# EAGLE design EXTRUSOR-NANO -3  (EAGLE 7.2.0)
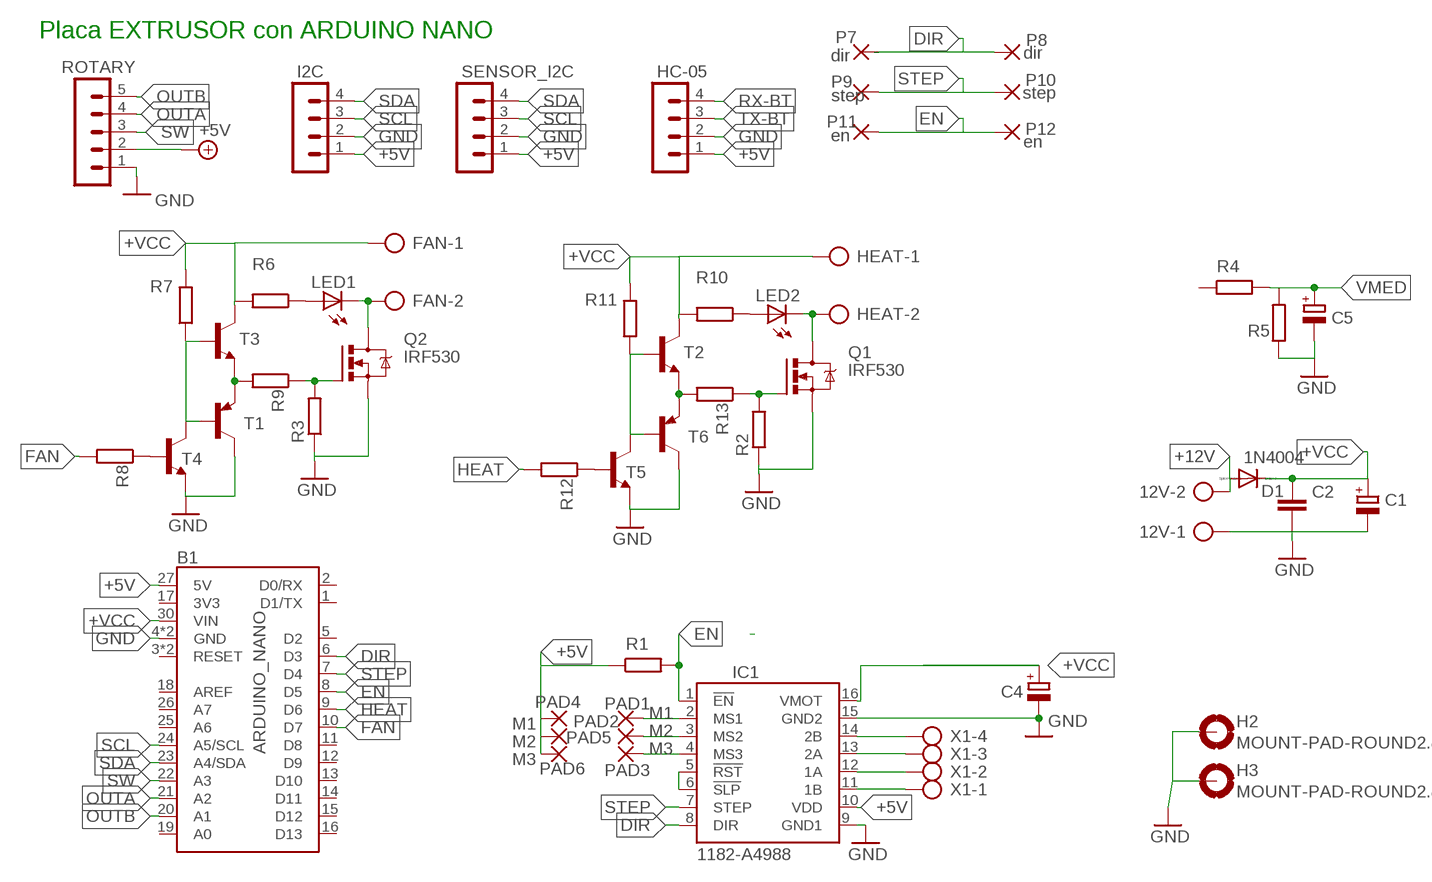
[diagram p0: schematic, sheet 1]

## Parts
12V  AK500/2  [AK500/2]
B1  ARDUINO_NANO  [NANO]
C1  CPOL-EUE2.5-6  [E2,5-6]
C2  C-EU025-025X050  [C025-025X050]
C4  CPOL-EUE2.5-5  [E2,5-5]
C5  CPOL-EUE2.5-5  [E2,5-5]
D1  1N4004  [DO41-10]
FAN  AK500/2  [AK500/2]
H2  MOUNT-PAD-ROUND2.8  [2,8-PAD]
H3  MOUNT-PAD-ROUND2.8  [2,8-PAD]
HC-05  MA04-1  [MA04-1]
HEAT  AK500/2  [AK500/2]
I2C  MA04-1  [MA04-1]
IC1  1182-A4988  [A4988]
LED1  LED3MM  [LED_3MM]
LED2  LED3MM  [LED_3MM]
P7  dir  WIREPAD1,6/0,9  [1,6/0,9]
P8  dir  WIREPAD1,6/0,9  [1,6/0,9]
P9  step  WIREPAD1,6/0,9  [1,6/0,9]
P10  step  WIREPAD1,6/0,9  [1,6/0,9]
P11  en  WIREPAD1,6/0,9  [1,6/0,9]
P12  en  WIREPAD1,6/0,9  [1,6/0,9]
PAD1  M1  WIREPAD1,6/0,9  [1,6/0,9]
PAD2  M2  WIREPAD1,6/0,9  [1,6/0,9]
PAD3  M3  WIREPAD1,6/0,9  [1,6/0,9]
PAD4  M1  WIREPAD1,6/0,9  [1,6/0,9]
PAD5  M2  WIREPAD1,6/0,9  [1,6/0,9]
PAD6  M3  WIREPAD1,6/0,9  [1,6/0,9]
Q1  IRF530  [TO220BV]
Q2  IRF530  [TO220BV]
R1  R-EU_0207/7  [0207/7]
R2  R-EU_0207/7  [0207/7]
R3  R-EU_0207/7  [0207/7]
R4  R-EU_0207/7  [0207/7]
R5  R-EU_0207/7  [0207/7]
R6  R-EU_0207/7  [0207/7]
R7  R-EU_0207/7  [0207/7]
R8  R-EU_0207/7  [0207/7]
R9  R-EU_0207/7  [0207/7]
R10  R-EU_0207/7  [0207/7]
R11  R-EU_0207/7  [0207/7]
R12  R-EU_0207/7  [0207/7]
R13  R-EU_0207/7  [0207/7]
ROTARY  MA05-1  [MA05-1]
SENSOR_I2C  MA04-1  [MA04-1]
T1  2N4126-PNP-TO92-CBE  [TO92-CBE]
T2  -NPN-TO92-EBC  [TO92-EBC]
T3  -NPN-TO92-EBC  [TO92-EBC]
T4  -NPN-TO92-EBC  [TO92-EBC]
T5  -NPN-TO92-EBC  [TO92-EBC]
T6  2N4126-PNP-TO92-CBE  [TO92-CBE]
X1  AK500/4  [AK500/4]

## Nets
+5V: B1.27(5V) HC-05.1 I2C.1 IC1.10(VDD) PAD4.1(P) PAD5.1(P) PAD6.1(P) R1.1 ROTARY.2 SENSOR_I2C.1
+12V: 12V.2 D1.A
+VCC: B1.30(VIN) C1.+ C2.1 C4.+ D1.C FAN.1 HEAT.1 IC1.16(VMOT) R6.2 R7.2 R10.2 R11.2 T2.C T3.C
DIR: B1.6(D3) IC1.8(DIR) P7.1(P) P8.1(P)
EN: B1.8(D5) IC1.1(!EN) P11.1(P) P12.1(P) R1.2
FAN: B1.10(D7) R8.2
GND: 12V.1 B1.4(GND) B1.29(GND) C1.- C2.2 C4.- C5.- H2.B2,8(MOUNT) H3.B2,8(MOUNT) HC-05.2 I2C.2 IC1.9(GND1) IC1.15(GND2) Q1.S Q2.S R2.1 R3.1 R5.1 ROTARY.1 SENSOR_I2C.2 T1.C T4.E T5.E T6.C
HEAT: B1.9(D6) R12.2
N$1: IC1.5(!RST) IC1.6(!SLP)
N$2: IC1.4(MS3) PAD3.1(P)
N$3: IC1.3(MS2) PAD2.1(P)
N$4: IC1.14(2B) X1.4
N$5: IC1.2(MS1) PAD1.1(P)
N$6: LED1.A R6.1
N$7: Q2.G R3.2 R9.1
N$8: R9.2 T1.E T3.E
N$9: IC1.13(2A) X1.3
N$10: IC1.12(1A) X1.2
N$11: IC1.11(1B) X1.1
N$12: LED2.A R10.1
N$13: FAN.2 LED1.K(C) Q2.D
N$14: R7.1 T1.B T3.B T4.C
N$15: R8.1 T4.B
N$16: Q1.G R2.2 R13.1
N$20: HEAT.2 LED2.K(C) Q1.D
N$21: R13.2 T2.E T6.E
N$22: R11.1 T2.B T5.C T6.B
N$23: R12.1 T5.B
OUTA: B1.21(A2) ROTARY.4
OUTB: B1.20(A1) ROTARY.5
RX-BT: HC-05.4
SCL: B1.24(A5/SCL) I2C.3 SENSOR_I2C.3
SDA: B1.23(A4/SDA) I2C.4 SENSOR_I2C.4
STEP: B1.7(D4) IC1.7(STEP) P9.1(P) P10.1(P)
SW: B1.22(A3) ROTARY.3
TX-BT: HC-05.3
VMED: C5.+ R4.2 R5.2
Unconnected: B1.1(D1/TX) B1.2(D0/RX) B1.3(RESET) B1.5(D2) B1.11(D8) B1.12(D9) B1.13(D10) B1.14(D11) B1.15(D12) B1.16(D13) B1.17(3V3) B1.18(AREF) B1.19(A0) B1.25(A6) B1.26(A7) B1.28(RESET) R4.1

## Notes on the sheet
- Placa EXTRUSOR con ARDUINO NANO

## Library data of the parts
12V FAN HEAT = con-ptr500:AK500/2: CONNECTOR; OC_FARNELL: unknown; OC_NEWARK: unknown
B1 = treser_lib:ARDUINO_NANO: Arduino Nano
C1 C4 C5 = rcl:CPOL-EU: POLARIZED CAPACITOR, European symbol
C2 = rcl:C-EU: CAPACITOR, European symbol
D1 = diode:1N4004: DIODE general purpose rectifier, 1 A
H2 H3 = holes:MOUNT-PAD-ROUND: MOUNTING PAD, round
HC-05 I2C SENSOR_I2C = con-lstb:MA04-1: PIN HEADER; OC_FARNELL: unknown; OC_NEWARK: unknown
IC1 = pololu-stepper-driver:1182-A4988: A4988 Stepper Motor Driver Carrier #1182 A4988 Stepper Motor Driver Carrier <https://www.pololu.com/product/1182> in Japan, Suzaku Lab. Ltd. <https://suzakugiken.jp/> #1182 A4988ステッピングモータドライバ <https://szc.jp/po1182>
LED1 LED2 = treser_lib:LED: LEDs
P7-P12 PAD1-PAD6 = wirepad:WIREPAD: Wire PAD connect wire on PCB
Q1 Q2 = transistor-power:IRF530: HEXFET Power MOSFET
R1-R13 = rcl:R-EU_: RESISTOR, European symbol
ROTARY = con-lstb:MA05-1: PIN HEADER; OC_FARNELL: unknown; OC_NEWARK: unknown
T1 T6 = transistor:*-PNP-: PNP Transistror
T2-T5 = transistor:*-NPN-: NPN Transistror BF959 corrected 2008.03.06
X1 = con-ptr500:AK500/4: CONNECTOR; OC_FARNELL: unknown; OC_NEWARK: unknown

## Board
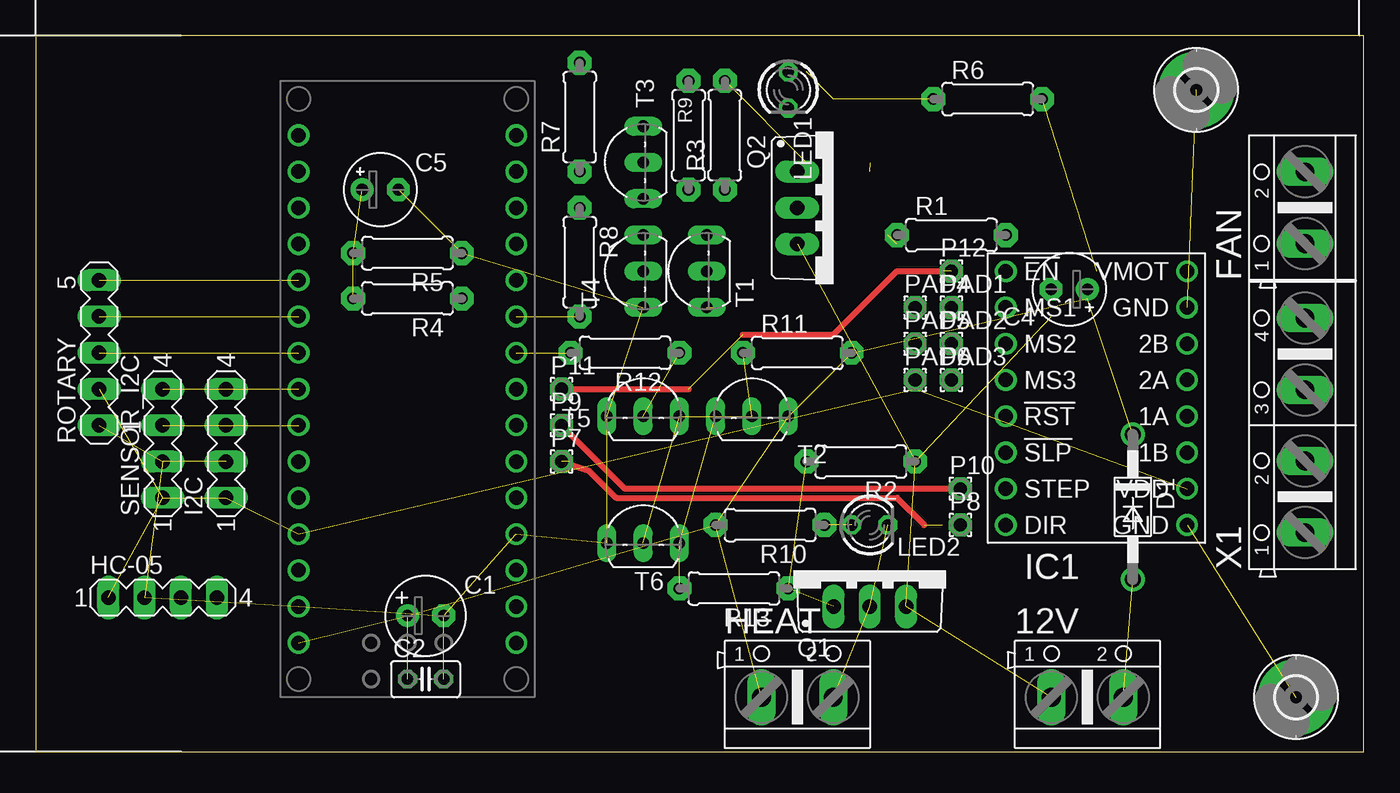
[diagram p1: board, top side]
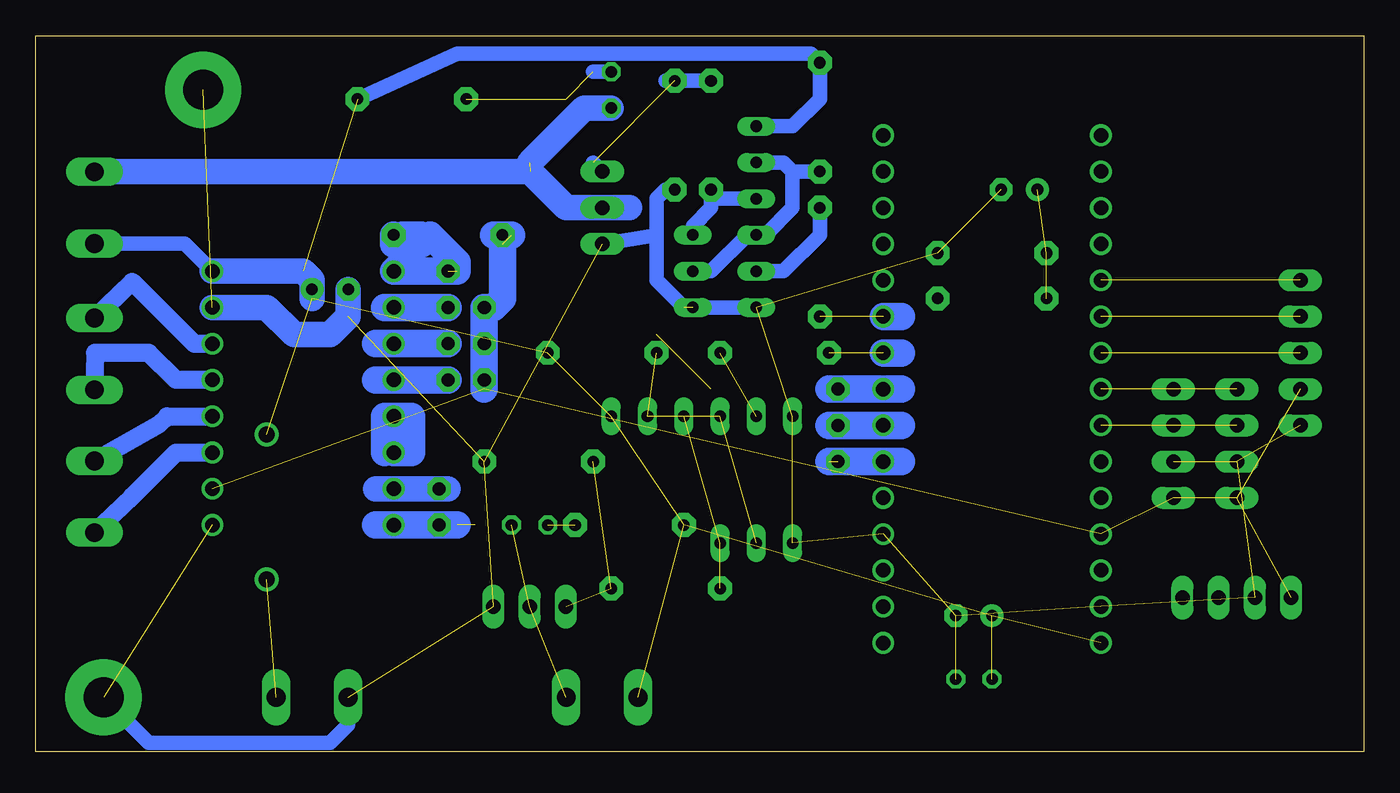
[diagram p2: board, bottom side, seen from below]

Size 93.02 x 50.15 mm. Coordinates in mm from the lower left corner, seen from the top.
Outline: 0,0 93.02,0 93.02,50.15 0,50.15 0,0
Copper layers (1*16): Top 0.035mm / dielectric 1.5mm / Bottom 0.035mm
Design rules "default": minimum track width 10mil, minimum drill 24mil, track to track 8mil, track to pad 8mil, pad to pad 8mil, via to via 8mil, smd to smd 8mil, copper to edge 40mil, drill to drill 8mil, minimum pad ring 10mil, minimum via ring 8mil, stop-mask expansion 4mil, vias tented up to drill 0mil, thermal gap 10mil

### Footprints (pad centres in the part's own frame; a part is rotated, then mirrored left to right if it is on the bottom)
AK500/2 = drill 1.321 long: 1 -2.515,0; 2 2.515,0
NANO = drill 1.016: 1 -7.62,17.78; 2 -7.62,15.24; 3 -7.62,12.7; 4 -7.62,10.16; 5 -7.62,7.62; 6 -7.62,5.08; 7 -7.62,2.54; 8 -7.62,0; 9 -7.62,-2.54; 10 -7.62,-5.08; 11 -7.62,-7.62; 12 -7.62,-10.16; 13 -7.62,-12.7; 14 -7.62,-15.24; 15 -7.62,-17.78; 16 7.62,-17.78; 17 7.62,-15.24; 18 7.62,-12.7; 19 7.62,-10.16; 20 7.62,-7.62; 21 7.62,-5.08; 22 7.62,-2.54; 23 7.62,0; 24 7.62,2.54; 25 7.62,5.08; 26 7.62,7.62; 27 7.62,10.16; 28 7.62,12.7; 29 7.62,15.24; 30 7.62,17.78
E2,5-6 = drill 0.813 pad 1.6: + -1.27,0 | drill 0.813 pad 1.6 octagon: - 1.27,0
C025-025X050 = drill 0.813 octagon: 1 -1.27,0; 2 1.27,0
E2,5-5 = drill 0.813 pad 1.6: + -1.27,0 | drill 0.813 pad 1.6 octagon: - 1.27,0
DO41-10 = drill 1.118: A 5.08,0; C -5.08,0
2,8-PAD = drill 2.8 pad 5.334: B2,8 0,0
MA04-1 = drill 1.016 long: 1 -3.81,0; 2 -1.27,0; 3 1.27,0; 4 3.81,0
A4988 = drill 1.016: 1 -6.35,8.89; 2 -6.35,6.35; 3 -6.35,3.81; 4 -6.35,1.27; 5 -6.35,-1.27; 6 -6.35,-3.81; 7 -6.35,-6.35; 8 -6.35,-8.89; 9 6.35,-8.89; 10 6.35,-6.35; 11 6.35,-3.81; 12 6.35,-1.27; 13 6.35,1.27; 14 6.35,3.81; 15 6.35,6.35; 16 6.35,8.89
LED_3MM = drill 0.813 octagon: A -1.27,0; K 1.27,0
1,6/0,9 = drill 0.914 pad 1.6 octagon: 1 0,0
TO220BV = drill 1.016 long: D 0,-2.54; G -2.54,-2.54; S 2.54,-2.54
0207/7 = drill 0.813 pad 1.676 octagon: 1 -3.81,0; 2 3.81,0
MA05-1 = drill 1.016 long: 1 -5.08,0; 2 -2.54,0; 3 0,0; 4 2.54,0; 5 5.08,0
TO92-CBE = drill 0.813 long: B 0,0; C -2.54,0; E 2.54,0
TO92-EBC = drill 0.813 long: B 0,-1.27; C 2.54,-1.27; E -2.54,-1.27
AK500/4 = drill 1.321 long: 1 -7.518,0; 2 -2.489,0; 3 2.489,0; 4 7.518,0

### Placement (x,y rotation side)
12V  73.66,3.81 0 top
B1  26.04,25.4 180 top
C1  27.3,9.53 0 top
C2  27.3,5.08 0 top
C4  72.39,32.38 180 top
C5  24.13,39.37 0 top
D1  76.83,17.14 270 top
FAN  88.9,38.1 90 top
H2  81.28,46.35 0 top
H3  88.27,3.81 0 top
HC-05  8.89,10.79 0 top
HEAT  53.34,3.81 0 top
I2C  13.34,21.59 90 top
IC1  74.3,24.77 0 top
LED1  52.71,46.35 270 top
LED2  58.42,15.87 0 top
P7  36.83,20.32 0 top
P8  64.77,15.87 0 top
P9  36.83,22.86 0 top
P10  64.77,18.41 0 top
P11  36.83,25.4 0 top
P12  64.13,33.66 0 top
PAD1  64.13,31.11 0 top
PAD2  64.13,28.57 0 top
PAD3  64.13,26.03 0 top
PAD4  61.59,31.11 0 top
PAD5  61.59,28.57 0 top
PAD6  61.59,26.03 0 top
Q1  58.42,12.7 0 top
Q2  55.88,38.1 270 top
R1  64.13,36.2 0 top
R2  57.79,20.32 180 top
R3  48.26,43.18 90 top
R4  26.04,31.75 180 top
R5  26.04,34.92 180 top
R6  66.67,45.72 0 top
R7  38.1,44.45 90 top
R8  38.1,34.29 270 top
R9  45.72,43.18 270 top
R10  51.44,15.87 180 top
R11  53.34,27.94 0 top
R12  41.27,27.94 180 top
R13  48.9,11.43 180 top
ROTARY  4.45,27.94 90 top
SENSOR_I2C  8.89,21.59 90 top
T1  46.99,33.66 90 top
T2  50.16,24.77 0 top
T3  41.27,41.27 90 top
T4  41.27,33.66 90 top
T5  42.55,24.77 0 top
T6  42.55,14.6 0 top
X1  88.9,22.86 90 top

### Tracks (layer width: path | path; a pad name or v marks a point on that pad's centre or on a via)
+5V  (7 unrouted)
  Bottom 1.93: 60.33,35.56 60.33,31.75 60.96,31.11 PAD4.1 PAD5.1 PAD6.1 61.59,25.4 | 59.69,36.2 R1.1 60.96,36.2
+12V  (1 unrouted)
+VCC  (9 unrouted)
  Bottom 1.016: T3.C 40.01,43.81 38.1,45.72 R7.2 38.73,48.9 63.5,48.9 R6.2 | FAN.1 82.57,35.59 IC1.16
  Bottom 1.778: 73.66,31.75 C4.+ 73.66,33.02 74.3,33.66 IC1.16
DIR  (2 unrouted)
  Top 0.406: P7.1 38.73,19.68 40.64,17.78 60.33,17.78 62.23,15.87
  Bottom 1.93: 32.39,20.32 B1.6 37.47,20.32 | 69.21,15.87 IC1.8 P8.1 63.5,15.87
EN  (2 unrouted)
  Top 0.406: P11.1 45.72,25.4 | 49.53,29.21 55.88,29.21 60.33,33.66 P12.1
  Bottom 1.93: 65.41,36.2 63.5,34.29 63.5,33.66 IC1.1 67.31,34.29 67.31,36.2 66.04,36.2 66.04,35.56 67.94,35.56 R1.2 | 37.47,25.4 P11.1 B1.8 32.39,25.4
FAN  (1 unrouted)
  Bottom 1.93: B1.10 32.39,30.48
GND  (19 unrouted)
  Bottom 1.016: 12V.1 71.14,1.88 72.39,0.63 85.09,0.63 H3.B2,8 | T4.E T1.C | R3.1 48.9,39.37 49.53,38.73 49.53,36.2 | 49.53,36.2 49.53,33.02 47.62,31.11 | Q2.S 49.53,36.2
  Bottom 1.778: IC1.15 76.83,31.11 74.93,29.21 72.39,29.21 71.12,30.48 C4.-
HEAT  (1 unrouted)
  Bottom 1.93: 32.39,27.94 B1.9
N$1
  Bottom 1.93: IC1.6 66.67,20.95 66.67,23.49 IC1.5 | IC1.5 68.58,23.49 68.58,22.86 | 68.58,20.95 68.58,22.86 | 68.58,22.86 IC1.5
N$2
  Bottom 1.93: PAD3.1 IC1.4 69.21,26.03
N$3
  Bottom 1.93: 69.21,28.57 IC1.3 PAD2.1
N$4
  Bottom 1.27: X1.4 86.26,32.92 81.91,28.57 IC1.14
N$5
  Bottom 1.93: PAD1.1 IC1.2 68.58,31.11
N$6  (2 unrouted)
  Bottom 1.016: 53.98,47.62 LED1.A
N$7  (1 unrouted)
  Bottom 1.016: R9.1 R3.2 48.9,46.99 | 53.98,41.27 Q2.G
N$8
  Bottom 1.016: T1.E 46.99,36.83 45.72,38.1 R9.2 45.09,38.73 T3.E
N$9
  Bottom 1.27: IC1.13 83.18,26.03 85.09,27.94 88.85,27.94 X1.3
N$10
  Bottom 1.27: X1.2 84.4,22.91 83.82,23.49 IC1.12
N$11
  Bottom 1.27: X1.1 86.26,17.88 83.18,20.95 IC1.11
N$12  (1 unrouted)
N$13  (1 unrouted)
  Bottom 1.778: FAN.2 58.4,40.61 55.88,38.1 Q2.D 51.44,38.1 | LED1.K 54.61,45.09 58.42,41.27
N$14
  Bottom 1.016: 40.01,40.64 40.01,38.1 41.91,36.2 T4.C 43.18,36.2 45.72,33.66 T1.B | 40.01,40.64 R7.1 | T3.B 40.64,41.27 40.01,40.64
N$15
  Bottom 1.016: T4.B 40.64,33.66 38.1,36.2 R8.1
N$16  (2 unrouted)
N$20  (2 unrouted)
N$21  (2 unrouted)
N$22  (3 unrouted)
N$23  (1 unrouted)
OUTA  (1 unrouted)
OUTB  (1 unrouted)
SCL  (2 unrouted)
SDA  (2 unrouted)
STEP
  Top 0.406: P10.1 41.27,18.41 P9.1
  Bottom 1.778: 69.21,18.41 IC1.7 P10.1 64.13,18.41
  Bottom 1.93: 32.39,22.86 B1.7 P9.1 37.47,22.86
SW  (1 unrouted)
VMED  (2 unrouted)